# Altium project PCB_Project.PrjPcb
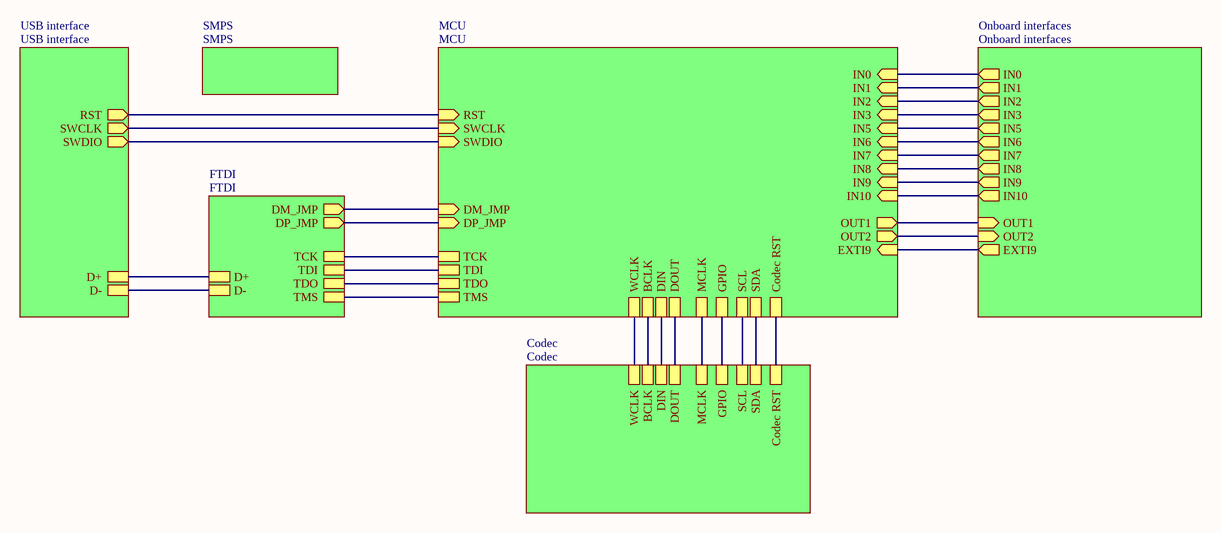
[diagram p0: Main.SchDoc]
7 sheets, 119 parts. Net scope: hierarchical (ports join the sheet entries above them; power ports are global).
Board file: MK1.PcbDoc
Sheets:
  Main.SchDoc
    MCU = MCU.SchDoc
    SMPS = SMPS.SchDoc
    USB interface = USB interface.SchDoc
    FTDI = FTDI.SchDoc
    Codec = Codec.SchDoc
    Onboard interfaces = Onboard interfaces.SchDoc

## Sheet Main.SchDoc
size A4; SheetNumber: 1; SheetTotal: 7

### Sub-sheets
Codec = Codec: WCLK, BCLK, DIN, DOUT, MCLK, GPIO, SCL, SDA, Codec RST
FTDI = FTDI: D+, D-, TCK, TDI, TDO, TMS, DM_JMP (out), DP_JMP (out)
MCU = MCU: TCK, TDI, TDO, TMS, WCLK, BCLK, DIN, DOUT, MCLK, GPIO, SCL, SDA, Codec RST, DM_JMP (in), DP_JMP (in), RST (in), SWCLK (in), SWDIO (in), IN0 (in), IN1 (in), IN2 (in), IN3 (in), IN5 (in), IN6 (in), IN7 (in), IN8 (in), IN9 (in), IN10 (in), OUT1 (out), OUT2 (out), EXTI9 (in)
Onboard interfaces = Onboard interfaces: IN0 (out), IN1 (out), IN2 (out), IN3 (out), IN5 (out), IN6 (out), IN7 (out), IN8 (out), IN9 (out), IN10 (out), OUT1 (in), OUT2 (in), EXTI9 (out)
SMPS = SMPS: no entries
USB interface = USB interface: D+, D-, RST (out), SWCLK (out), SWDIO (out)

### Nets
ADC1_IN0: sheet MCU/IN0, sheet Onboard interfaces/IN0
ADC1_IN1: sheet MCU/IN1, sheet Onboard interfaces/IN1
ADC1_IN2: sheet MCU/IN2, sheet Onboard interfaces/IN2
ADC1_IN3: sheet MCU/IN3, sheet Onboard interfaces/IN3
ADC1_IN5: sheet MCU/IN5, sheet Onboard interfaces/IN5
ADC1_IN6: sheet MCU/IN6, sheet Onboard interfaces/IN6
ADC1_IN7: sheet MCU/IN7, sheet Onboard interfaces/IN7
ADC1_IN8: sheet MCU/IN8, sheet Onboard interfaces/IN8
ADC1_IN9: sheet MCU/IN9, sheet Onboard interfaces/IN9
ADC1_IN10: sheet MCU/IN10, sheet Onboard interfaces/IN10
BCLK: sheet MCU/BCLK, sheet Codec/BCLK
Codec RST: sheet MCU/Codec RST, sheet Codec/Codec RST
D+: sheet USB interface/D+, sheet FTDI/D+
D-: sheet USB interface/D-, sheet FTDI/D-
DAC1_OUT1: sheet MCU/OUT1, sheet Onboard interfaces/OUT1
DAC1_OUT2: sheet MCU/OUT2, sheet Onboard interfaces/OUT2
DIN: sheet MCU/DIN, sheet Codec/DIN
DOUT: sheet MCU/DOUT, sheet Codec/DOUT
GPIO: sheet MCU/GPIO, sheet Codec/GPIO
I2C1_SCL: sheet MCU/SCL, sheet Codec/SCL
I2C1_SDA: sheet MCU/SDA, sheet Codec/SDA
I2S1_MCK: sheet MCU/MCLK, sheet Codec/MCLK
I2S1_WS: sheet MCU/WCLK, sheet Codec/WCLK
JTCK/SWCLK: sheet MCU/TCK, sheet MCU/SWCLK, sheet USB interface/SWCLK, sheet FTDI/TCK
JTDI: sheet MCU/TDI, sheet FTDI/TDI
JTDO: sheet MCU/TDO, sheet FTDI/TDO
JTMS/SWDIO: sheet MCU/TMS, sheet MCU/SWDIO, sheet USB interface/SWDIO, sheet FTDI/TMS
RST: sheet MCU/RST, sheet USB interface/RST
NetJ1_2: sheet MCU/DM_JMP, sheet FTDI/DM_JMP
NetJ6_2: sheet MCU/DP_JMP, sheet FTDI/DP_JMP
NetR17_2: sheet MCU/EXTI9, sheet Onboard interfaces/EXTI9

## Sheet MCU.SchDoc: MK1 MCU
size A3; Author: Mikkel Nielsen; DrawnBy: Mikkel Nielsen; Engineer: Mikkel Nielsen; SheetNumber: 2; SheetTotal: 7
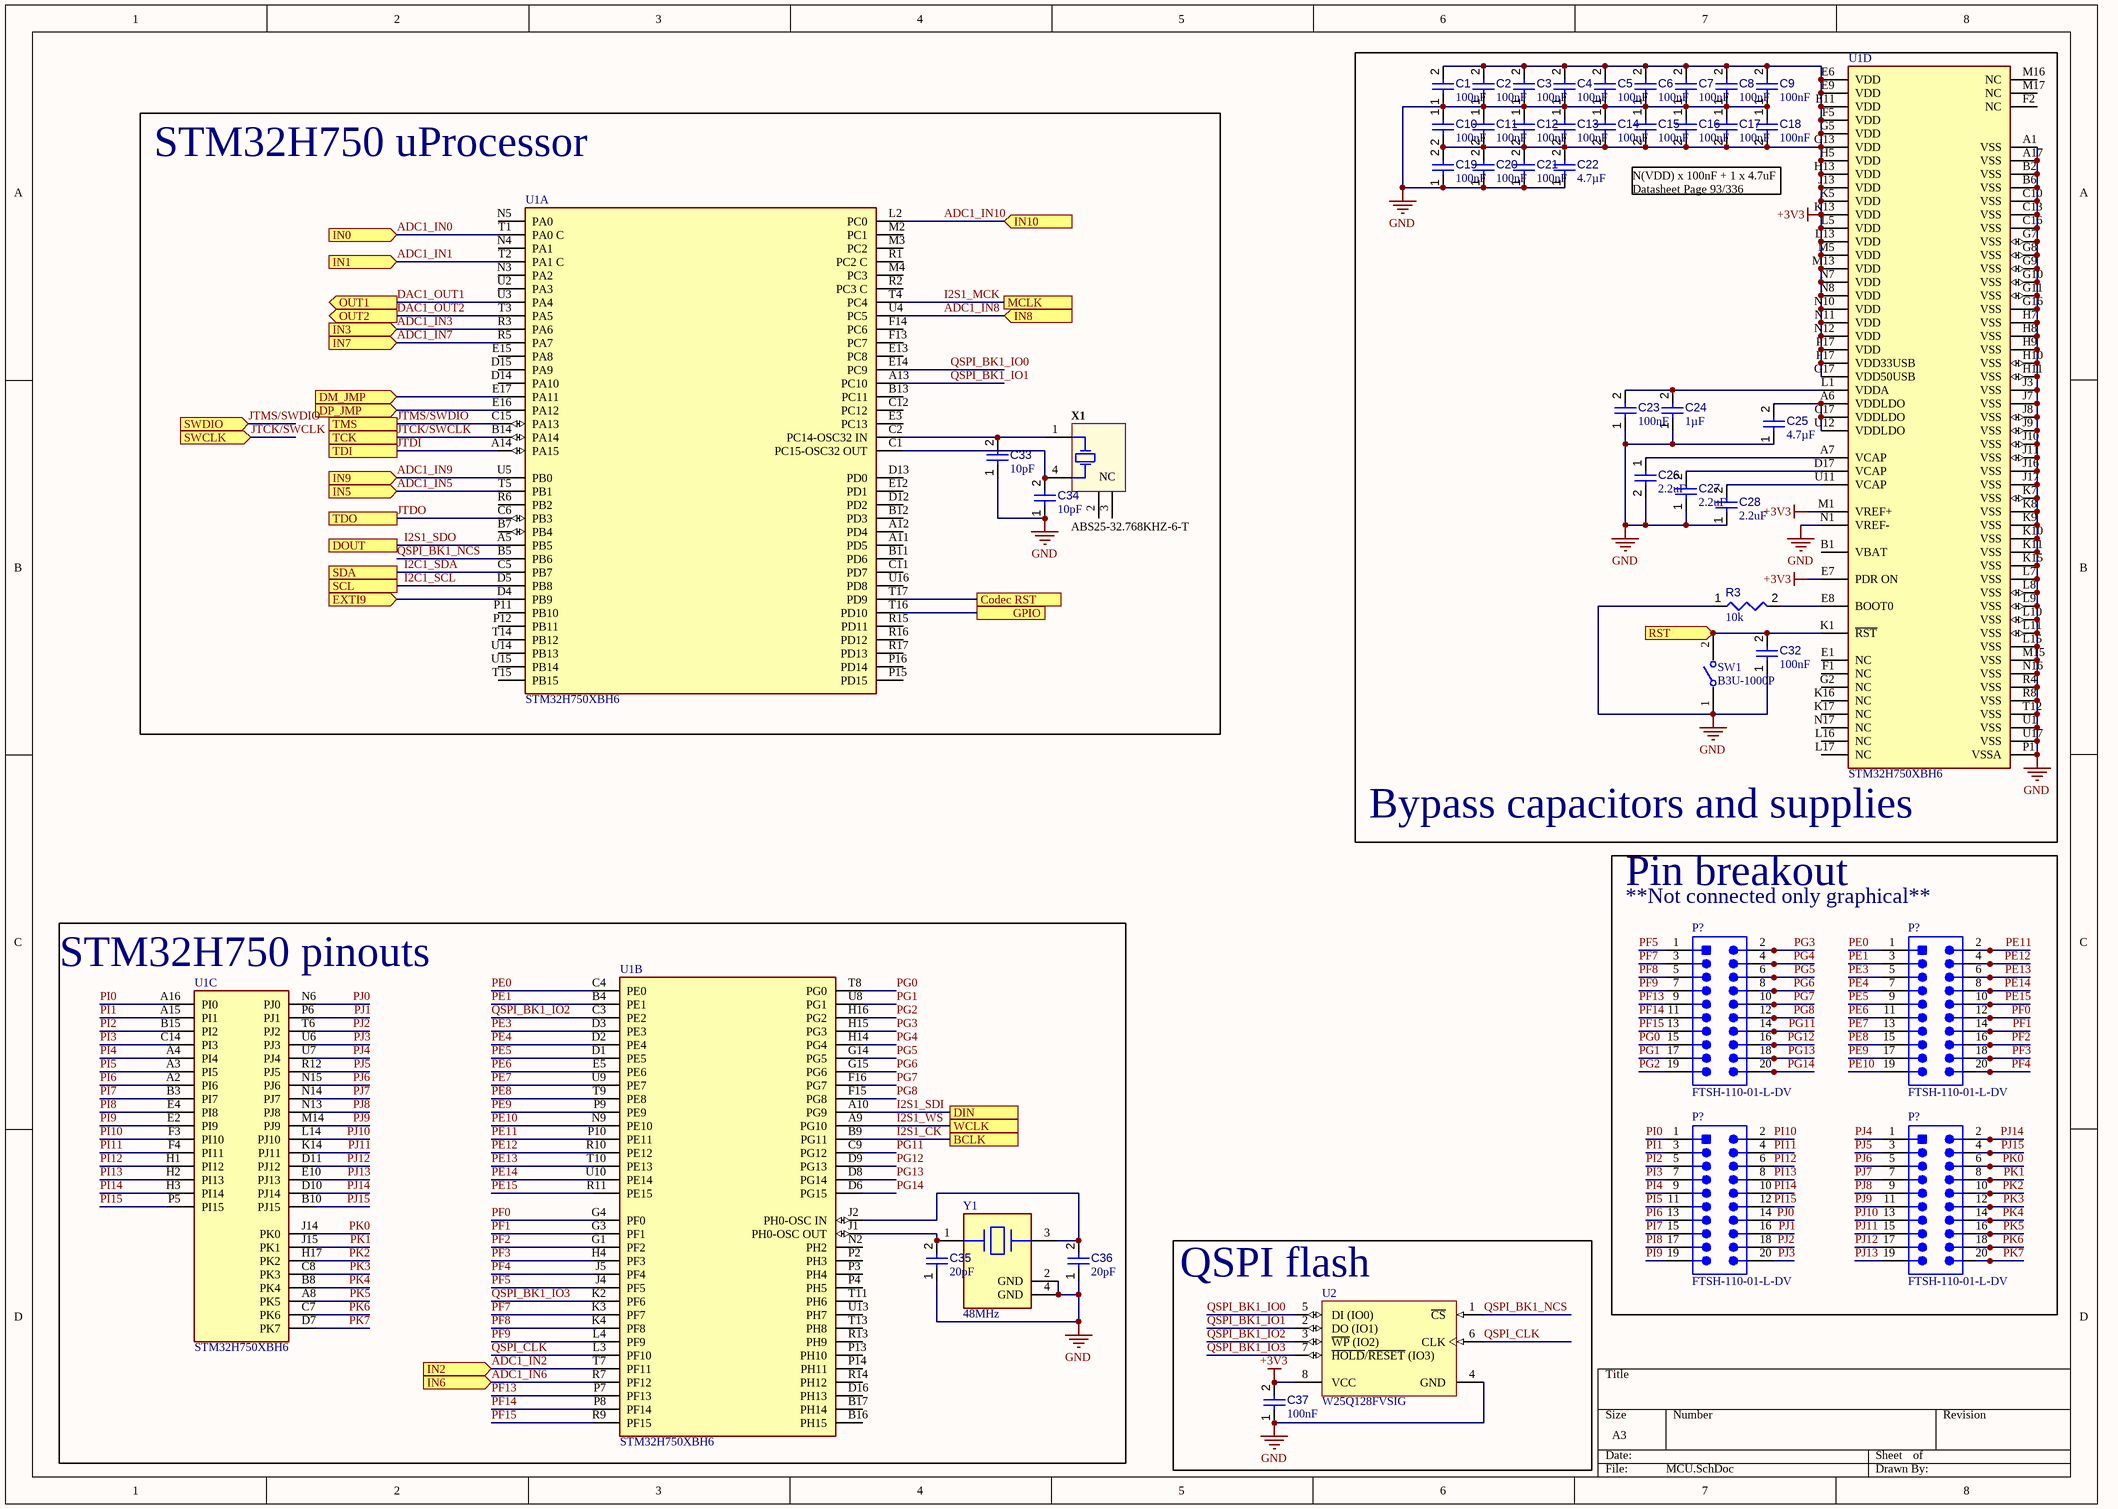
[diagram p1: MCU.SchDoc]

### Parts
(Parts that share a designator on the sheet are numbered #1, #2 ... from top to bottom, then left to right.)
C1  value 100nF  [CAPC0603(1608)100_L]  (hidden comment: Capacitor 470nF +/-20% 25V 0603)
C2  value 100nF  [CAPC0603(1608)100_L]  (hidden comment: Capacitor 470nF +/-20% 25V 0603)
C3  value 100nF  [CAPC0603(1608)100_L]  (hidden comment: Capacitor 470nF +/-20% 25V 0603)
C4  value 100nF  [CAPC0603(1608)100_L]  (hidden comment: Capacitor 470nF +/-20% 25V 0603)
C5  value 100nF  [CAPC0603(1608)100_L]  (hidden comment: Capacitor 470nF +/-20% 25V 0603)
C6  value 100nF  [CAPC0603(1608)100_L]  (hidden comment: Capacitor 470nF +/-20% 25V 0603)
C7  value 100nF  [CAPC0603(1608)100_L]  (hidden comment: Capacitor 470nF +/-20% 25V 0603)
C8  value 100nF  [CAPC0603(1608)100_L]  (hidden comment: Capacitor 470nF +/-20% 25V 0603)
C9  value 100nF  [CAPC0603(1608)100_L]  (hidden comment: Capacitor 470nF +/-20% 25V 0603)
C10  value 100nF  [CAPC0603(1608)100_L]  (hidden comment: Capacitor 470nF +/-20% 25V 0603)
C11  value 100nF  [CAPC0603(1608)100_L]  (hidden comment: Capacitor 470nF +/-20% 25V 0603)
C12  value 100nF  [CAPC0603(1608)100_L]  (hidden comment: Capacitor 470nF +/-20% 25V 0603)
C13  value 100nF  [CAPC0603(1608)100_L]  (hidden comment: Capacitor 470nF +/-20% 25V 0603)
C14  value 100nF  [CAPC0603(1608)100_L]  (hidden comment: Capacitor 470nF +/-20% 25V 0603)
C15  value 100nF  [CAPC0603(1608)100_L]  (hidden comment: Capacitor 470nF +/-20% 25V 0603)
C16  value 100nF  [CAPC0603(1608)100_L]  (hidden comment: Capacitor 470nF +/-20% 25V 0603)
C17  value 100nF  [CAPC0603(1608)100_L]  (hidden comment: Capacitor 470nF +/-20% 25V 0603)
C18  value 100nF  [CAPC0603(1608)100_L]  (hidden comment: Capacitor 470nF +/-20% 25V 0603)
C19  value 100nF  [CAPC0603(1608)100_L]  (hidden comment: Capacitor 470nF +/-20% 25V 0603)
C20  value 100nF  [CAPC0603(1608)100_L]  (hidden comment: Capacitor 470nF +/-20% 25V 0603)
C21  value 100nF  [CAPC0603(1608)100_L]  (hidden comment: Capacitor 470nF +/-20% 25V 0603)
C22  value 4.7µF  [CAPC0603(1608)100_L]  (hidden comment: Capacitor 4.7µF +/-20% 10V 0603)
C23  value 100nF  [CAPC0603(1608)100_L]  (hidden comment: Capacitor 470nF +/-20% 25V 0603)
C24  value 1µF  [CAPC0603(1608)100_L]  (hidden comment: Capacitor 1µF +/-40% 50V 0603)
C25  value 4.7µF  [CAPC0603(1608)100_L]  (hidden comment: Capacitor 4.7µF +/-20% 10V 0603)
C26  value 2.2uF  [CAPC0603(1608)100_L]  (hidden comment: Capacitor 470nF +/-20% 25V 0603)
C27  value 2.2uF  [CAPC0603(1608)100_L]  (hidden comment: Capacitor 470nF +/-20% 25V 0603)
C28  value 2.2uF  [CAPC0603(1608)100_L]  (hidden comment: Capacitor 470nF +/-20% 25V 0603)
C32  value 100nF  [CAPC0603(1608)100_L]  (hidden comment: Capacitor 470nF +/-20% 25V 0603)
C33  value 10pF  [CAPC0603(1608)100_L]  (hidden comment: Capacitor 470nF +/-20% 25V 0603)
C34  value 10pF  [CAPC0603(1608)100_L]  (hidden comment: Capacitor 470nF +/-20% 25V 0603)
C35  value 20pF  [CAPC0603(1608)100_L]  (hidden comment: Capacitor 470nF +/-20% 25V 0603)
C36  value 20pF  [CAPC0603(1608)100_L]  (hidden comment: Capacitor 470nF +/-20% 25V 0603)
C37  value 100nF  [CAPC0603(1608)100_L]  (hidden comment: Capacitor 470nF +/-20% 25V 0603)
P?#1  FTSH-110-01-L-DV  [SMTC-FTSH-110-01-L-DV_V]  (graphical)
P?#2  FTSH-110-01-L-DV  [SMTC-FTSH-110-01-L-DV_V]  (graphical)
P?#3  FTSH-110-01-L-DV  [SMTC-FTSH-110-01-L-DV_V]  (graphical)
P?#4  FTSH-110-01-L-DV  [SMTC-FTSH-110-01-L-DV_V]  (graphical)
R3  value 10k  [RESC0603(1608)_L]  (hidden comment: 120R3J)
SW1  B3U-1000P  [FP-B3U-1000P-MFG]
U1  STM32H750XBH6  [FP-TFBGA2650-A07U-MFG]  (parts A,B,C,D of 4)
U2  W25Q128FVSIG  [WINB-SOIC-8_M]
X1  ABS25-32.768KHZ-6-T  [ABRA-ABS25-4_V]
Y1  48MHz  [FP-ABM3B-MFG]

### Blocks framed on the sheet
Bypass capacitors and supplies: C1-C28 C32 R3 SW1 U1
STM32H750 uProcessor: C33 C34 U1 X1
Pin breakout: P?#1-P?#4
STM32H750 pinouts: C35 C36 U1 Y1
QSPI flash: C37 U2

### Ports
BCLK, Codec RST, DIN, DM_JMP (in), DOUT, DP_JMP (in), EXTI9 (in), GPIO, IN0 (in), IN1 (in), IN2 (in), IN3 (in), IN5 (in), IN6 (in), IN7 (in), IN8 (in), IN9 (in), IN10 (in), MCLK, OUT1 (out), OUT2 (out), RST (in), SCL, SDA, SWCLK (in), SWDIO (in), TCK, TDI, TDO, TMS, WCLK

### Nets
+3V3: C1.2 C2.2 C3.2 C4.2 C5.2 C6.2 C7.2 C8.2 C9.2 C10.2 C11.2 C12.2 C13.2 C14.2 C15.2 C16.2 C17.2 C18.2 C19.2 C20.2 C21.2 C22.2 C37.2 U1.E6(VDD) U1.E7(PDR_ON) U1.E9(VDD) U1.E11(VDD) U1.F5(VDD) U1.F17(VDD33USB) U1.G5(VDD) U1.G13(VDD) U1.G17(VDD50USB) U1.H5(VDD) U1.H13(VDD) U1.J13(VDD) U1.K5(VDD) U1.K13(VDD) U1.L5(VDD) U1.L13(VDD) U1.M1(VREF+) U1.M5(VDD) U1.M13(VDD) U1.N7(VDD) U1.N8(VDD) U1.N10(VDD) U1.N11(VDD) U1.N12(VDD) U1.P17(VDD) U2.8(VCC)
GND: C1.1 C2.1 C3.1 C4.1 C5.1 C6.1 C7.1 C8.1 C9.1 C10.1 C11.1 C12.1 C13.1 C14.1 C15.1 C16.1 C17.1 C18.1 C19.1 C20.1 C21.1 C22.1 C23.1 C24.1 C25.1 C26.2 C27.1 C28.1 C32.1 C33.1 C34.1 C35.1 C36.1 C37.1 R3.1 SW1.1 U1.A1(VSS) U1.A17(VSS) U1.B2(VSS) U1.B6(VSS) U1.C10(VSS) U1.C13(VSS) U1.C16(VSS) U1.G7(VSS) U1.G8(VSS) U1.G9(VSS) U1.G10(VSS) U1.G11(VSS) U1.G16(VSS) U1.H7(VSS) U1.H8(VSS) U1.H9(VSS) U1.H10(VSS) U1.H11(VSS) U1.J3(VSS) U1.J7(VSS) U1.J8(VSS) U1.J9(VSS) U1.J10(VSS) U1.J11(VSS) U1.J16(VSS) U1.J17(VSS) U1.K7(VSS) U1.K8(VSS) U1.K9(VSS) U1.K10(VSS) U1.K11(VSS) U1.K15(VSS) U1.L7(VSS) U1.L8(VSS) U1.L9(VSS) U1.L10(VSS) U1.L11(VSS) U1.L15(VSS) U1.M15(VSS) U1.N1(VREF-) U1.N16(VSS) U1.P1(VSSA) U1.R4(VSS) U1.R8(VSS) U1.T12(VSS) U1.U1(VSS) U1.U17(VSS) U2.4(GND) Y1.2(GND) Y1.4(GND)
ADC1_IN0: U1.T1(PA0_C) ; port IN0
ADC1_IN1: U1.T2(PA1_C) ; port IN1
ADC1_IN2: U1.T7(PF11) ; port IN2
ADC1_IN3: U1.R3(PA6) ; port IN3
ADC1_IN5: U1.T5(PB1) ; port IN5
ADC1_IN6: U1.R7(PF12) ; port IN6
ADC1_IN7: U1.R5(PA7) ; port IN7
ADC1_IN8: U1.U4(PC5) ; port IN8
ADC1_IN9: U1.U5(PB0) ; port IN9
ADC1_IN10: U1.L2(PC0) ; port IN10
Codec RST: U1.T17(PD9) ; port Codec RST
DAC1_OUT1: U1.U3(PA4) ; port OUT1
DAC1_OUT2: U1.T3(PA5) ; port OUT2
GPIO: U1.T16(PD10) ; port GPIO
I2C1_SCL: U1.D5(PB8) ; port SCL
I2C1_SDA: U1.C5(PB7) ; port SDA
I2S1_CK: U1.B9(PG11) ; port BCLK  [project net BCLK]
I2S1_MCK: U1.T4(PC4) ; port MCLK
I2S1_SDI: U1.A10(PG9) ; port DIN  [project net DIN]
I2S1_SDO: U1.A5(PB5) ; port DOUT  [project net DOUT]
I2S1_WS: U1.A9(PG10) ; port WCLK
JTCK/SWCLK: U1.B14(PA14) ; port TCK, port SWCLK
JTDI: U1.A14(PA15) ; port TDI
JTDO: U1.C6(PB3) ; port TDO
JTMS/SWDIO: U1.C15(PA13) ; port TMS, port SWDIO
PE0: P?#2.1 U1.C4(PE0)
PE1: P?#2.3 U1.B4(PE1)
PE3: P?#2.5 U1.D3(PE3)
PE4: P?#2.7 U1.D2(PE4)
PE5: P?#2.9 U1.D1(PE5)
PE6: P?#2.11 U1.E5(PE6)
PE7: P?#2.13 U1.U9(PE7)
PE8: P?#2.15 U1.T9(PE8)
PE9: P?#2.17 U1.P9(PE9)
PE10: P?#2.19 U1.N9(PE10)
PE11: P?#2.2 U1.P10(PE11)
PE12: P?#2.4 U1.R10(PE12)
PE13: P?#2.6 U1.T10(PE13)
PE14: P?#2.8 U1.U10(PE14)
PE15: P?#2.10 U1.R11(PE15)
PF0: P?#2.12 U1.G4(PF0)
PF1: P?#2.14 U1.G3(PF1)
PF2: P?#2.16 U1.G1(PF2)
PF3: P?#2.18 U1.H4(PF3)
PF4: P?#2.20 U1.J5(PF4)
PF5: P?#1.1 U1.J4(PF5)
PF7: P?#1.3 U1.K3(PF7)
PF8: P?#1.5 U1.K4(PF8)
PF9: P?#1.7 U1.L4(PF9)
PF13: P?#1.9 U1.P7(PF13)
PF14: P?#1.11 U1.P8(PF14)
PF15: P?#1.13 U1.R9(PF15)
PG0: P?#1.15 U1.T8(PG0)
PG1: P?#1.17 U1.U8(PG1)
PG2: P?#1.19 U1.H16(PG2)
PG3: P?#1.2 U1.H15(PG3)
PG4: P?#1.4 U1.H14(PG4)
PG5: P?#1.6 U1.G14(PG5)
PG6: P?#1.8 U1.G15(PG6)
PG7: P?#1.10 U1.F16(PG7)
PG8: P?#1.12 U1.F15(PG8)
PG11: P?#1.14 U1.C9(PG12)
PG12: P?#1.16 U1.D9(PG13)
PG13: P?#1.18 U1.D8(PG14)
PG14: P?#1.20 U1.D6(PG15)
PI0: P?#3.1 U1.A16(PI0)
PI1: P?#3.3 U1.A15(PI1)
PI2: P?#3.5 U1.B15(PI2)
PI3: P?#3.7 U1.C14(PI3)
PI4: P?#3.9 U1.A4(PI4)
PI5: P?#3.11 U1.A3(PI5)
PI6: P?#3.13 U1.A2(PI6)
PI7: P?#3.15 U1.B3(PI7)
PI8: P?#3.17 U1.E4(PI8)
PI9: P?#3.19 U1.E2(PI9)
PI10: P?#3.2 U1.F3(PI10)
PI11: P?#3.4 U1.F4(PI11)
PI12: P?#3.6 U1.H1(PI12)
PI13: P?#3.8 U1.H2(PI13)
PI14: P?#3.10 U1.H3(PI14)
PI15: P?#3.12 U1.P5(PI15)
PJ0: P?#3.14 U1.N6(PJ0)
PJ1: P?#3.16 U1.P6(PJ1)
PJ2: P?#3.18 U1.T6(PJ2)
PJ3: P?#3.20 U1.U6(PJ3)
PJ4: P?#4.1 U1.U7(PJ4)
PJ5: P?#4.3 U1.R12(PJ5)
PJ6: P?#4.5 U1.N15(PJ6)
PJ7: P?#4.7 U1.N14(PJ7)
PJ8: P?#4.9 U1.N13(PJ8)
PJ9: P?#4.11 U1.M14(PJ9)
PJ10: P?#4.13 U1.L14(PJ10)
PJ11: P?#4.15 U1.K14(PJ11)
PJ12: P?#4.17 U1.D11(PJ12)
PJ13: P?#4.19 U1.E10(PJ13)
PJ14: P?#4.2 U1.D10(PJ14)
PJ15: P?#4.4 U1.B10(PJ15)
PK0: P?#4.6 U1.J14(PK0)
PK1: P?#4.8 U1.J15(PK1)
PK2: P?#4.10 U1.H17(PK2)
PK3: P?#4.12 U1.C8(PK3)
PK4: P?#4.14 U1.B8(PK4)
PK5: P?#4.16 U1.A8(PK5)
PK6: P?#4.18 U1.C7(PK6)
PK7: P?#4.20 U1.D7(PK7)
QSPI_BK1_IO0: U1.E14(PC9) U2.5(DI_(IO0))
QSPI_BK1_IO1: U1.A13(PC10) U2.2(DO_(IO1))
QSPI_BK1_IO2: U1.C3(PE2) U2.3(~{WP}_(IO2))
QSPI_BK1_IO3: U1.K2(PF6) U2.7(~{HOLD}/~{RESET}_(IO3))
QSPI_BK1_NCS: U1.B5(PB6) U2.1(~{CS})
QSPI_CLK: U1.L3(PF10) U2.6(CLK)
RST: C32.2 SW1.2 U1.K1(~{RST}) ; port RST
NetC23_2: C23.2 C24.2 U1.L1(VDDA)
NetC25_2: C25.2 U1.A6(VDDLDO) U1.C17(VDDLDO) U1.U12(VDDLDO)
NetC26_1: C26.1 U1.A7(VCAP)
NetC27_2: C27.2 U1.D17(VCAP)
NetC28_2: C28.2 U1.U11(VCAP)
NetC33_2: C33.2 U1.C2(PC14-OSC32_IN) X1.1(X1)
NetC34_2: C34.2 U1.C1(PC15-OSC32_OUT) X1.4(X2)
NetC35_2: C35.2 U1.J1(PH0-OSC_OUT) Y1.1
NetC36_2: C36.2 U1.J2(PH0-OSC_IN) Y1.3
NetJ1_2: U1.E17(PA11) ; port DM_JMP
NetJ6_2: U1.E16(PA12) ; port DP_JMP
NetR3_2: R3.2 U1.E8(BOOT0)
NetR17_2: U1.D4(PB9) ; port EXTI9

Not connected (* = marked no-connect by the designer): U1 A11(PD5) A12(PD4) B1(VBAT) B7(PB4) B11(PD6) B12(PD3) B13(PC11) B16(PH15) B17(PH14) C11(PD7) C12(PC12) D12(PD2) D13(PD0) D14(PA10) D15(PA9) D16(PH13) E1(NC) E3(PC13) E12(PD1) E13(PC8) E15(PA8) F1(NC) F2(NC) F13(PC7) F14(PC6) G2(NC) K16(NC) K17(NC) L16(NC) L17(NC) M2(PC1) M3(PC2) M4(PC3) M16(NC) M17(NC) N2(PH2) N3(PA2) N4(PA1) N5(PA0) N17(NC) P2(PH3) P3(PH4) P4(PH5) P11(PB10) P12(PB11) P13(PH10) P14(PH11) P15(PD15) P16(PD14) R1(PC2_C) R2(PC3_C) R6(PB2) R13(PH9) R14(PH12) R15(PD11) R16(PD12) R17(PD13) T11(PH6) T13(PH8) T14(PB12) T15(PB15) U2(PA3) U13(PH7) U14(PB13) U15(PB14) U16(PD8); X1 2(NC) 3(NC)

### Notes on the sheet
- N(VDD) x 100nF + 1 x 4.7uF
  Datasheet Page 93/336
- (near P?#2) **Not connected only graphical**

### Library data of the parts
C1-C21 C23 C26-C28 C32-C37 = CMP-001-00077-3: Chip Capacitor, 470nF +/-20%, 25V, 0603, Thickness 1 mm; Tolerance: 10%; Max Operating Temperature: 85°C; Voltage Rating: 25V; Pins: 2; Case/Package: 0603; Mounting Technology: SMT; Min Operating Temperature: -55°C
C22 C25 = CMP-001-00076-4: Chip Capacitor, 4.7µF +/-20%, 10V, 0603, Thickness 1 mm; Tolerance: 10%; Mounting Technology: SMT; Case/Package: 0603; Pins: 2; Min Operating Temperature: -55°C; Max Operating Temperature: 85°C; Voltage Rating: 10V
C24 = CMP-001-00078-4: Chip Capacitor, 1µF +/-40%, 50V, 0603, Thickness 1 mm; Tolerance: 10%; Case/Package: 0603; Pins: 2; Max Operating Temperature: 85°C; Voltage Rating: 50V; Mounting Technology: SMT; Min Operating Temperature: -55°C
P?#1-P?#4 = CMP-2000-06294-2: Male Header, Pitch 1.27 mm, 2 x 10 Position, Height 6.1 mm, -55 to 125 degC, RoHS, Tube; Manufacturer: Samtec; Online Catalog: FTSHSeries; Row Spacing: 0.050"(1.27mm); Number of Positions Loaded: All; Connector Type: Header,Unshrouded; Product Training Modules: Board-to-BoardConnectors; Featured Product: Board-To-BoardInterconnectSystems; Other Names: SAM1161-10; Mating Products: SAM9021-ND-CONNRECEPT20POS.50"SMTFLE-110-01-G-DV-TR-ND-CONNSKT1.27MM20POSDUALSMDFLE-110-01-G-DV-K-TR-ND-CONNSKT1.27MM20POSDUALSMDFLE-110-01-G-DV-A-K-TR-ND-CONNSKT1.27MM20POSDUALSMDSFMC-110-L2-S-D-P-TR-ND-CONN.05"SURFACE20POSSMTSAM1153-10-ND-CONNRCPT20POSDUAL.05"SMDSAM1155-10-ND-CONNRCPT20POSDUAL.05"SMDSAM1154-10-ND-CONNRCPT20POSDUAL.05"SMDSFMC-110-L3-S-D-ND-CONN.05"SURFACE20POSSTRAIGHTSFMC-110-02-S-D-ND-CONN.05"SURFACE20POSSMTSAM1226-10-ND-CONNRCPT.05"20POSDUALSMD; EDA / CAD Models: DownloadfromAcceleratedDesigns; Number of Positions: 20; Catalog Drawings: FTSHSeriesFTSHSeriesSMTSide; Package Reference: FTSH-110-01-L-DV; Family: RectangularConnectors-Headers,MalePins; Mounting Technology: SurfaceMount; Contact Type: MalePin; Manufacturer URL: http://www.samtec.com/; Package URL: http://suddendocs.samtec.com/prints/ftsh-1xx-xx-xxx-dv-xxx-xxx-mkt.pdf; Package Description: Male Header, Pitch 1.27 mm, 2 x 10 Position, Height 6.1 mm; Packaging: Bulk; Termination: Solder; Category: Connectors,Interconnects; Fastening Type: -; Datasheet Version: F-215 , 02/2016; Contact Finish Thickness: 10µin(0.25µm); Number of Rows: 2; Datasheet URL: http://suddendocs.samtec.com/catalog_english/ftsh_smt.pdf; Mounting Type: SurfaceMount; Series: FTSH; Features: -; Contact Finish: Gold; Standard Package: 1; Color: Black; Pitch: 0.050"(1.27mm); Contact Mating Length: 0.120"(3.05mm)
R3 = CMP-009-00069-2: 120R 0.1W 5% 0603 (1608 Metric)  SMD; Power: 100mW; Mounting Technology: SMT; Tolerance: 5%; Case/Package: 0603; Pins: 2
SW1 = CMP-2100-03586-2: SWITCH TACTILE SPST-NO 0.05A 12V; Contact Resistance: 100mR; Operating Force: 1.5N; Max Current Rating: 50mA; Switch Travel: 0.15mm; Actuator Type: Standard; Mechanical Life: 200000Cycles; Ratings: Dust Proof; Illumination Type: Non-Illuminated; Throw Configuration: SPST; Actuator Length: 0.4mm; Switch Function: Off-Mom; Height: 1.2mm; Width: 3mm; Weight: 0.000776oz; Contact Material: Silver; Max Voltage Rating (DC): 12V; Insulation Resistance: 100MR; Lead Free: Lead Free; Current Rating: 50mA; Termination: SMD/SMT; Length: 4mm; Voltage Rating (DC): 12V; Contact Current Rating: 50mA; Orientation: Straight; Depth: 2.5mm; Max Operating Temperature: 70°C; Packaging: Tape and Reel; Min Operating Temperature: -25°C; Package Quantity: 1; Mount: Surface Mount; Electrical Life: 200000Cycles
U1 = CMP-12105-000062-1: IC MCU 32BIT 128KB FLASH TFBGA; Manufacturer: STMicroelectronics; Number Of Cores: 1; Ram Size: 1MBytes; Interface: I2C,SPI,UART,USART,CAN,USB,LIN,IrDA,Ethernet,I2S; Number Of Timers/Counters: 10; Number Of Pwm Channels: 2; Core Architecture: ARM Cortex-M7; Frequency: 400MHz; Number Of Spi Channels: 6; Number Of Uart Channels: 9; Min Supply Voltage: 1.62V; Max Junction Temp: +125°C; Standoff Height: 0.15mm; Memory Size: 128KBytes; Nominal Supply Current: 24-348mA; Max Supply Voltage: 3.6V; Data Bus Width: 32bits; Number Of I2C Channels: 4; Number Of Adc Channels: 36; Number Of I/Os: 168; Number Of A/D Converters: 3; RoHS: TRUE; Package: TFBGA2650-A07U; Ambient Temperature Range Low: -40°C; Temperature Range High: +125°C; ComponentLink2Description: Datasheet; Number Of Usb Channels: 1; Device Class L2: Embedded Processors and Controllers; Automotive: No; Ambient Temperature Range High: +85°C; Octopart: https://octopart.com/stm32h750xbh6-stmicroelectronics-93259822; Lead Free: Yes; Ipc Land Pattern Name: BGA289N80P17X17_1400X1400X110; Manufacturer Part Number: STM32H750XBH6; Device Class L1: Integrated Circuits (ICs); Temperature: -40°C to +125°C; Device Class L3: Microcontrollers; ComponentLink2URL: https://www.st.com/resource/en/datasheet/stm32h750xb.pdf; Temperature Range Low: -40°C; Digikey Description: IC MCU 32BIT 128KB FLASH TFBGA; Number Of Ethernet Channels: 1; Height: 1.1mm; Category: IC; Memory Type: FLASH
U2 = CMP-2000-05005-1: 3V 128M-Bit Serial Flash Memory with Dual/Quad SPI & QPI, 2.7 to 3.6 V, -40 to 85 degC, 8-Pin SOIC, RoHS, Tape and Reel; Manufacturer: Winbond; Number of Words: 16777216; Address Bus: 24b; Word Size: 8b; Boot Type: NotRequired; Supply Current: 20mA; Operating Supply Voltage (Max): 3.6V; Sync/Async: Synchronous; Rad Hardened: No; Interface Type: Serial(SPI); Access Time (Max): 7ns; Operating Supply Voltage (Min): 2.7V; Operating Supply Voltage (Typ): 3/3.3V; Programmable: Yes; Density: 134217728Bit; Cell Type: NOR; Package Description: 8-Pin Small Outline Integrated Circuit, Body 5.28 x 5.28 mm, Pitch 1.27 mm; Datasheet URL: http://download.siliconexpert.com/pdfs/2015/11/30/6/42/17/890/win_/manual/3w25q128fv20rev.l2008242015.pdf; Package Reference: SS-8; Package Type: SOICW; Datasheet Version: Rev. L, 08/2015; Manufacturer URL: http://www.winbond.com/hq/index.html?__locale=en; Pin Count: 8; Operating Temperature Classification: Industrial; Operating Temperature (Min): -40C; Program/Erase Volt (Typ): 2.7to3.6V; Operating Temperature (Max): 85C; Mounting: SurfaceMount; Operating Temp Range: -40Cto85C
X1 = CMP-2000-05036-1: Low Frequency Crystal, 32.768 KHz, 6 pF, +/- 20 ppm, -40 to 85 degC, 4-Pin SMD, RoHS, Tape and Reel; Manufacturer: Abracon; Tolerance: 20PPM; ESR: 50kOhms; Case Width: 3.8mm; Case Height: 2.5mm; Case Length: 8mm; Load Capacitance: 6pF; Operating Temperature Range: -40Cto+85C; Package Reference: ABS25; Factory Pack Quantity: 3000; Package Description: 4-Pin Surface Mount Device, Body 8 x 3.8 mm, Pitch 5.5 mm; Frequency: 32.768kHz; Termination Style: SMD/SMT; Manufacturer URL: http://www.abracon.com/; Type: LowFrequencyCrystal; Dimensions: 3.8mmWx8mmLx2.5mmH; Product Category: Crystals; Series: ABS25; RoHS: Details; Package / Case: 8mmx3.8mm; Datasheet Version: Jun-17; Brand: ABRACON; Datasheet URL: https://datasheet.ciiva.com/854/abs25-854528.pdf; Packaging: Reel; Mounting Style: SMD/SMT
Y1 = CMP-27762-010589-1: Crystal 48MHz ±20ppm 18pF SMD-4 5mm x 3.2mm; Frequency Stability: 50ppm; Series Resistance: 50R; Package Quantity: 1000; Packaging: Tape and Reel; Frequency Tolerance: 20ppm; Depth: 3.2mm; Max Operating Temperature: 70°C; Lead Free: Lead Free; ESR (Equivalent Series Resistance): 50R; Operating Frequency: 48 MHz; REACH SVHC: No SVHC; Frequency: 48MHz; Length: 5mm; Min Operating Temperature: -20°C; Tolerance: 20ppm; Load Capacitance: 18pF; Case/Package: SMD/SMT; Series: ABM3B; Number of Pins: 4; Termination: SMD/SMT; Height: 0.043inch; Resistor Type: Ceramic; Mount: Surface Mount; Width: 3.2mm

## Sheet SMPS.SchDoc
size A4; SheetNumber: 4; SheetTotal: 7
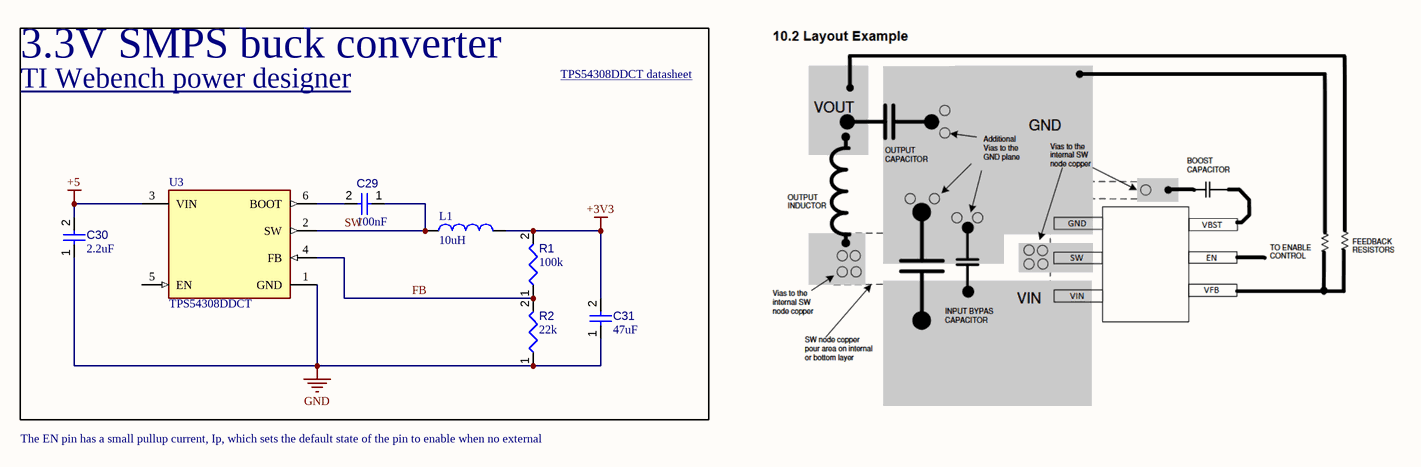
[diagram p2: SMPS.SchDoc]

### Parts
C29  value 100nF  [CAPC0805(2012)145_L]  (hidden comment: Capacitor 4.7µF +/-40% 25V 0805)
C30  value 2.2uF  [CAPC0603(1608)100_L]  (hidden comment: Capacitor 4.7µF +/-20% 10V 0603)
C31  value 47uF  [CAPC1608X90X35ML15T15]  (hidden comment: Capacitor 1uF +/- 10% 16V 0603)
L1  10uH  [WE-PD2A_7850]
R1  value 100k  [RESC0402(1005)_L]  (hidden comment: 121KR2F)
R2  value 22k  [RESC0603(1608)_L]  (hidden comment: 120R3J)
U3  TPS54308DDCT  [FP-DDC0006A-IPC_A]

### Nets
+3V3: C31.2 L1.2 R1.2
+5: C30.2 U3.3(VIN)
GND: C30.1 C31.1 R2.1 U3.1(GND)
FB: R1.1 R2.2 U3.4(FB)
SW: C29.1 L1.1 U3.2(SW)
NetC29_2: C29.2 U3.6(BOOT)

Not connected (* = marked no-connect by the designer): U3 5(EN)

### Notes on the sheet
- 3.3V SMPS buck converter
- TI Webench power designer <https://webench.ti.com/power-designer/switching-regulator>
- TPS54308DDCT datasheet <https://www.ti.com/lit/ds/symlink/tps54308.pdf>
- The EN pin has a small pullup current, Ip, which sets the default state of the pin to enable when no external

### Library data of the parts
C29 = CMP-001-00080-4: Chip Capacitor, 4.7µF +/-40%, 25V, 0805, Thickness 1.45 mm; Tolerance: 20%; Voltage Rating: 25V; Min Operating Temperature: -55°C; Max Operating Temperature: 85°C; Pins: 2; Mounting Technology: SMT; Case/Package: 0805
C30 = CMP-001-00076-4: as C22 on sheet MCU; Mounting Technology: SMT; Case/Package: 0603; Pins: 2; Min Operating Temperature: -55°C; Max Operating Temperature: 85°C; Voltage Rating: 10V
C31 = CMP-001-00004-6: Chip Capacitor, 1 uF, +/- 10%, 16 V, 0603 (1608 Metric); Capacitor Type: Ceramic; Mounting Technology: SM; RoHS Compliant: True; Min Operating Temperature: -55°C; Case/Package: 0603; Pins: 2; Voltage Rating: 16V; Max Operating Temperature: 125°C; Tolerance: 10%
L1 = CMP-03913-56466919-1: 78477510 Inductor, Aec-Q200, 10Uh, Unshld, 2.3A Rohs Compliant: Yes; Voltage Rating: 80V; Shielding: Unshielded; Tolerance: 20%; DC Resistance (DCR): 40mΩ; Saturation Current: 2.95A; Inductance: 10µH; Core Material: Ferrite; Self Resonant Frequency: 23MHz; Test Frequency: 10kHz; Composition: Wirewound; Width: 7.8mm; Ambient Temperature Range Low: -40°C; RoHS: Compliant; Ambient Temperature Range High: 85°C; Height: 5mm; Number of Pins: 2; Current Rating: 2.3A; Mount: Surface Mount; Min Operating Temperature: -40°C; NexarPartId: 56466919; Ratings: AEC-Q200; Height - Seated (Max): 5.5118mm; Case/Package: Nonstandard; Max Operating Temperature: 125°C; Length: 7mm
R1 = CMP-009-00070-2: 121K 0.063W 1% 0402 (1005 Metric)  SMD; Power: 63mW; Case/Package: 0402; Pins: 2; Tolerance: 1%; Mounting Technology: SMT
R2 = CMP-009-00069-2: as R3 on sheet MCU; Mounting Technology: SMT; Tolerance: 5%; Case/Package: 0603; Pins: 2
U3 = CMP-04918-000241-1: IC REG BUCK ADJ 3A TSOT23-6; Max Input Voltage: 28V; Synchronous Rectifier: Yes; Max Output Voltage: 26V; Switching Frequency: 350kHz; Number of Outputs: 1; Output Configuration: Positive; Output Type: Adjustable; Min Input Voltage: 4.5V; Min Output Voltage: 1V; Min Operating Temperature: -40°C; Case/Package: SOT-23-6; Mount: Surface Mount; RoHS Compliant: Yes; Max Operating Temperature: 125°C; Output Current: 3A; Packaging: Tape and Reel

## Sheet USB interface.SchDoc
size A4; SheetNumber: 3; SheetTotal: 7
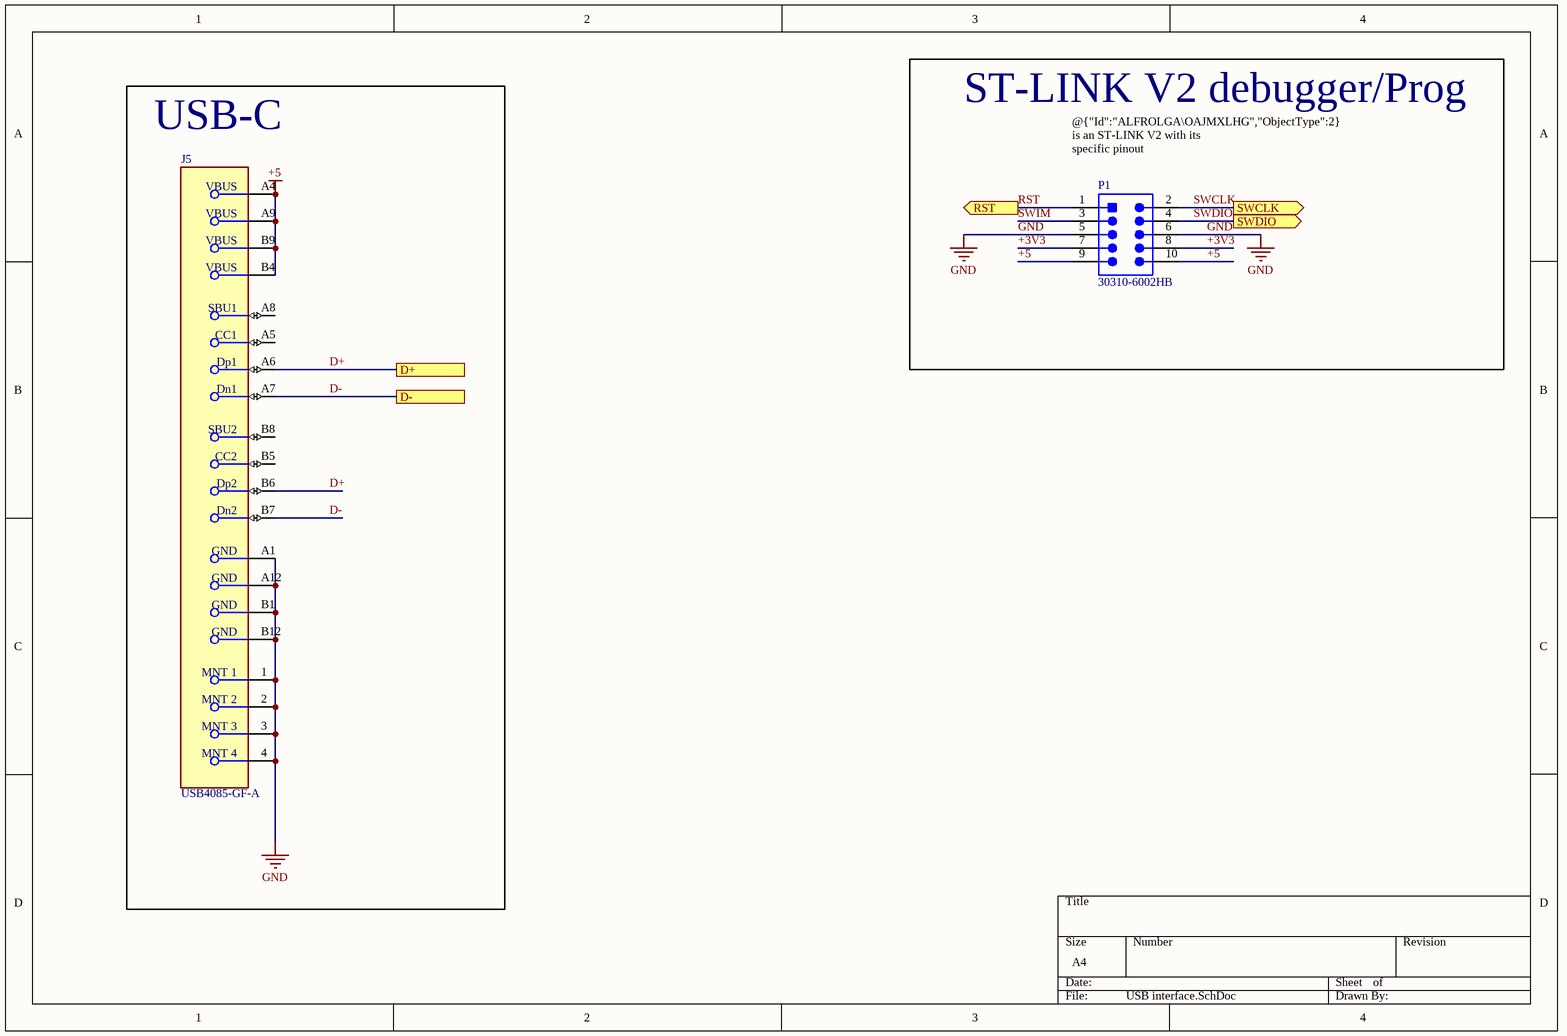
[diagram p3: USB interface.SchDoc]

### Parts
J5  USB4085-GF-A  [FP-USB4085-GF-A-MFG]
P1  30310-6002HB  [3M-30310-6002HB-10_V]

### Blocks framed on the sheet
USB-C: J5
ST-LINK V2 debugger/Prog: P1

### Ports
D+, D-, RST (out), SWCLK (out), SWDIO (out)

### Nets
+5: J5.A4(VBUS) J5.A9(VBUS) J5.B4(VBUS) J5.B9(VBUS) P1.9 P1.10
GND: J5.1(MNT_1) J5.2(MNT_2) J5.3(MNT_3) J5.4(MNT_4) J5.A1(GND) J5.A12(GND) J5.B1(GND) J5.B12(GND) P1.5 P1.6
+3V3: P1.7 P1.8
D+: J5.A6(Dp1) J5.B6(Dp2) ; port D+
D-: J5.A7(Dn1) J5.B7(Dn2) ; port D-
RST: P1.1 ; port RST
SWCLK: P1.2 ; port SWCLK  [project net JTCK/SWCLK]
SWDIO: P1.4 ; port SWDIO  [project net JTMS/SWDIO]
SWIM: P1.3

Not connected (* = marked no-connect by the designer): J5 A5(CC1) A8(SBU1) B5(CC2) B8(SBU2)

### Notes on the sheet
- (near P1) @{"Id":"ALFROLGA\OAJMXLHG","ObjectType":2} is an ST-LINK V2 with its specific pinout

### Library data of the parts
J5 = CMP-196119-000001-2: CONN RCPT USB2.0 TYPE C 24POS RA; Gender: Receptacle; Number of Positions: 16; USB Standard: USB 2.0; Orientation: Right Angle; Contact Plating: Gold; Contact Material: Copper Alloy
P1 = CMP-2000-05031-1: Male Header, Pitch 2.54 mm, 2 x 5 Position, Height 9.3 mm, Tail Length 2.79 mm, -55 to 105 degC, RoHS, Bulk; Manufacturer: 3M; Current Rating: 1A; Brand: 3MElectronicSolutionsDivision; Mounting Angle: Straight; Number of Positions: 10Position; Mating Post Length: 5.99mm; Pitch: 2.54mm; Manufacturer URL: http://www.3m.com/; Factory Pack Quantity: 1000; Mounting Style: StraightPin; Number of Rows: 2Row; Termination Post Length: 2.79mm; Contact Gender: Pin(Male); Contact Material: Brass; Termination Style: ThroughHole; Product: Headers; Packaging: Tray; Product Category: Headers&WireHousings; Type: Shrouded; Datasheet URL: http://datasheet.octopart.com/30310-6002HB-3M-datasheet-11537585.pdf; Datasheet Version: Apr-12; Contact Plating: Gold; Row Spacing: 2.54mm; Housing Material: Polyester; Series: 303; RoHS: Details

## Sheet FTDI.SchDoc
size A4; SheetNumber: 5; SheetTotal: 7
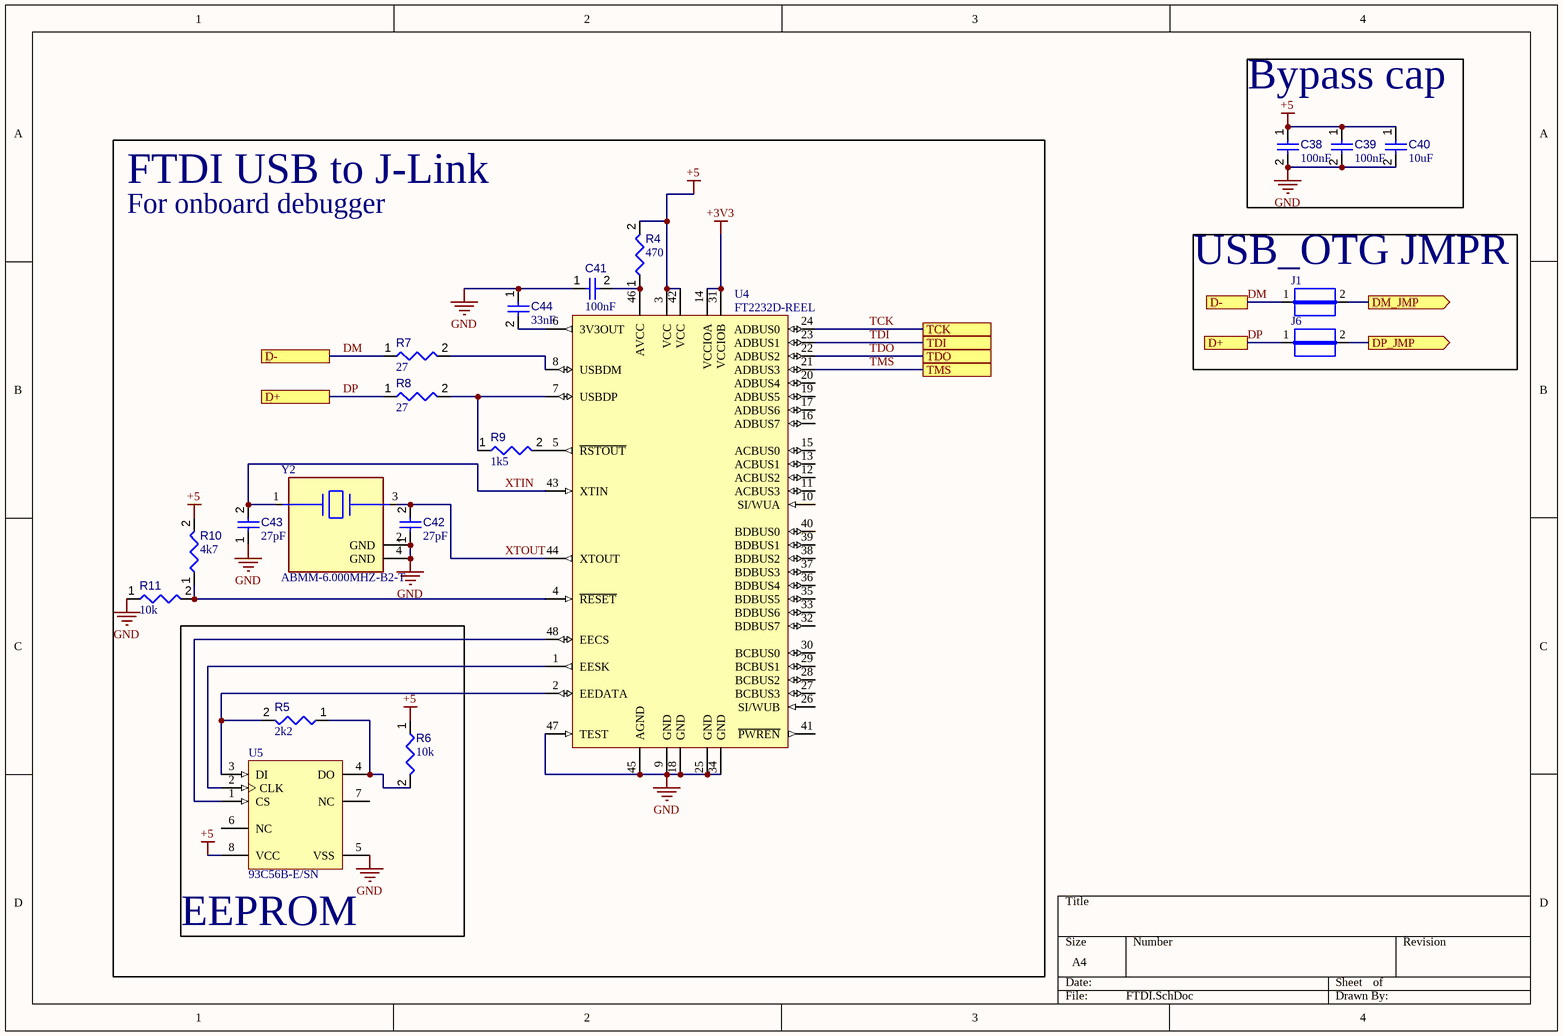
[diagram p4: FTDI.SchDoc]

### Parts
C38  value 100nF  [CAPC0603(1608)100_L]  (hidden comment: Capacitor 470nF +/-20% 25V 0603)
C39  value 100nF  [CAPC0603(1608)100_L]  (hidden comment: Capacitor 470nF +/-20% 25V 0603)
C40  value 10uF  [CAPC0603(1608)100_L]  (hidden comment: Capacitor 470nF +/-20% 25V 0603)
C41  value 100nF  [CAPC0603(1608)100_L]  (hidden comment: Capacitor 470nF +/-20% 25V 0603)
C42  value 27pF  [CAPC0603(1608)100_L]  (hidden comment: Capacitor 470nF +/-20% 25V 0603)
C43  value 27pF  [CAPC0603(1608)100_L]  (hidden comment: Capacitor 470nF +/-20% 25V 0603)
C44  value 33nF  [CAPC0603(1608)100_L]  (hidden comment: Capacitor 470nF +/-20% 25V 0603)
J1  JUMPER  [JUMPER]  (value not drawn)
J6  JUMPER  [JUMPER]  (value not drawn)
R4  value 470  [RESC0603(1608)_L]  (hidden comment: 120R3J)
R5  value 2k2  [RESC0603(1608)_L]  (hidden comment: 120R3J)
R6  value 10k  [RESC0603(1608)_L]  (hidden comment: 120R3J)
R7  value 27  [RESC0603(1608)_L]  (hidden comment: 120R3J)
R8  value 27  [RESC0603(1608)_L]  (hidden comment: 120R3J)
R9  value 1k5  [RESC0603(1608)_L]  (hidden comment: 120R3J)
R10  value 4k7  [RESC0603(1608)_L]  (hidden comment: 120R3J)
R11  value 10k  [RESC0603(1608)_L]  (hidden comment: 120R3J)
U4  FT2232D-REEL  [LQFP-48_L]
U5  93C56B-E/SN  [SOIC-SN8_M]
Y2  ABMM-6.000MHZ-B2-T  [FP-ABMM-MFG]

### Blocks framed on the sheet
Bypass cap: C38-C40
FTDI USB to J-Link: C41-C44 R4 R7-R11 U4 Y2
USB_OTG JMPR: J1 J6
EEPROM: R5 R6 U5

### Ports
D+, D-, DM_JMP (out), DP_JMP (out), TCK, TDI, TDO, TMS

### Nets
+3V3: U4.14(VCCIOA) U4.31(VCCIOB)
+5: C38.1 C39.1 C40.1 R4.2 R6.1 R10.2 U4.3(VCC) U4.42(VCC) U5.8(VCC)
GND: C38.2 C39.2 C40.2 C41.1 C42.1 C43.1 C44.1 R11.1 U4.9(GND) U4.18(GND) U4.25(GND) U4.34(GND) U4.45(AGND) U4.47(TEST) U5.5(VSS) Y2.2(GND) Y2.4(GND)
DM: J1.1 R7.1 ; port D-  [project net D-]
DP: J6.1 R8.1 ; port D+  [project net D+]
TCK: U4.24(ADBUS0) ; port TCK  [project net JTCK/SWCLK]
TDI: U4.23(ADBUS1) ; port TDI  [project net JTDI]
TDO: U4.22(ADBUS2) ; port TDO  [project net JTDO]
TMS: U4.21(ADBUS3) ; port TMS  [project net JTMS/SWDIO]
XTIN: C43.2 U4.43(XTIN) Y2.1
XTOUT: C42.2 U4.44(XTOUT) Y2.3
NetC41_2: C41.2 R4.1 U4.46(AVCC)
NetC44_2: C44.2 U4.6(3V3OUT)
NetJ1_2: J1.2 ; port DM_JMP
NetJ6_2: J6.2 ; port DP_JMP
NetR5_1: R5.1 R6.2 U5.4(DO)
NetR5_2: R5.2 U4.2(EEDATA) U5.3(DI)
NetR7_2: R7.2 U4.8(USBDM)
NetR8_2: R8.2 R9.1 U4.7(USBDP)
NetR9_2: R9.2 U4.5(~{RSTOUT})
NetR10_1: R10.1 R11.2 U4.4(~{RESET})
NetU4_1: U4.1(EESK) U5.2(CLK)
NetU4_48: U4.48(EECS) U5.1(CS)

Not connected (* = marked no-connect by the designer): U4 10(SI/WUA) 11(ACBUS3) 12(ACBUS2) 13(ACBUS1) 15(ACBUS0) 16(ADBUS7) 17(ADBUS6) 19(ADBUS5) 20(ADBUS4) 26(SI/WUB) 27(BCBUS3) 28(BCBUS2) 29(BCBUS1) 30(BCBUS0) 32(BDBUS7) 33(BDBUS6) 35(BDBUS5) 36(BDBUS4) 37(BDBUS3) 38(BDBUS2) 39(BDBUS1) 40(BDBUS0) 41(~{PWREN}); U5 6(NC) 7(NC)

### Notes on the sheet
- For onboard debugger

### Library data of the parts
C38-C44 = CMP-001-00077-3: as C1 on sheet MCU; Max Operating Temperature: 85°C; Voltage Rating: 25V; Pins: 2; Case/Package: 0603; Mounting Technology: SMT; Min Operating Temperature: -55°C
J1 J6 = CMP-009-00061-2: Pins: 2
R4-R11 = CMP-009-00069-2: as R3 on sheet MCU; Mounting Technology: SMT; Tolerance: 5%; Case/Package: 0603; Pins: 2
U4 = CMP-0579-00002-1: FT2232D Dual USB to Serial UART/FIFO IC, -40 to +85 degC, 48-Pin LQFP, Pb-Free, Tape and Reel; Manufacturer: FTDI; ComponentLink1Description: Manufacturer URL; ComponentLink1URL: http://www.ftdichip.com/; PackageDescription: 48-Pin Thin Quad Flat Pack, 7 x 7 mm Body, 0.5 mm Pitch; PackageVersion: Apr-11; PartNumber: FT2232D-REEL; ComponentLink2URL: http://www.ftdichip.com/Support/Documents/DataSheets/ICs/DS_FT2232D.pdf; ComponentLink2Description: Datasheet; PackageReference: LQFP-48; DatasheetVersion: ver 2.05, Apr-2011
U5 = CMP-0162-00233-1: 2K, 128x16-bit, 5.0V Microwire Serial EEPROM, 8-Pin SOIC 150mil, Extended Temperature; Code_JEDEC: MS-012; Code_IPC: SOIC127P600-8; DatasheetVersion: revF, May-2008; PackageReference: SOIC-SN8; PackageDescription: 8-Lead Plastic Small Outline (SN) - Narrow, 3.90mm Body [SOIC]; PackageVersion: revBB, Aug-2009
Y2 = CMP-27762-012698-1: CRYSTAL 6.0000MHZ 18PF SMD; Frequency Tolerance: 20ppm; Frequency: 6MHz; Series Resistance: 70R; Operating Frequency: 6 MHz; Frequency Stability: 50ppm; Load Capacitance: 18pF; Min Operating Temperature: -20°C; Number of Pins: 4; Packaging: Tape and Reel; Max Operating Temperature: 70°C; Case/Package: SMD/SMT; Tolerance: 20ppm; Height: 0.051inch; Mount: Surface Mount; Width: 5mm; Lead Free: Lead Free; Series: ABMM; ESR (Equivalent Series Resistance): 70R; Length: 0.276inch; Termination: SMD/SMT; Package Quantity: 1000; Resistor Type: Ceramic

## Sheet Codec.SchDoc
size A4; SheetNumber: 6; SheetTotal: 7
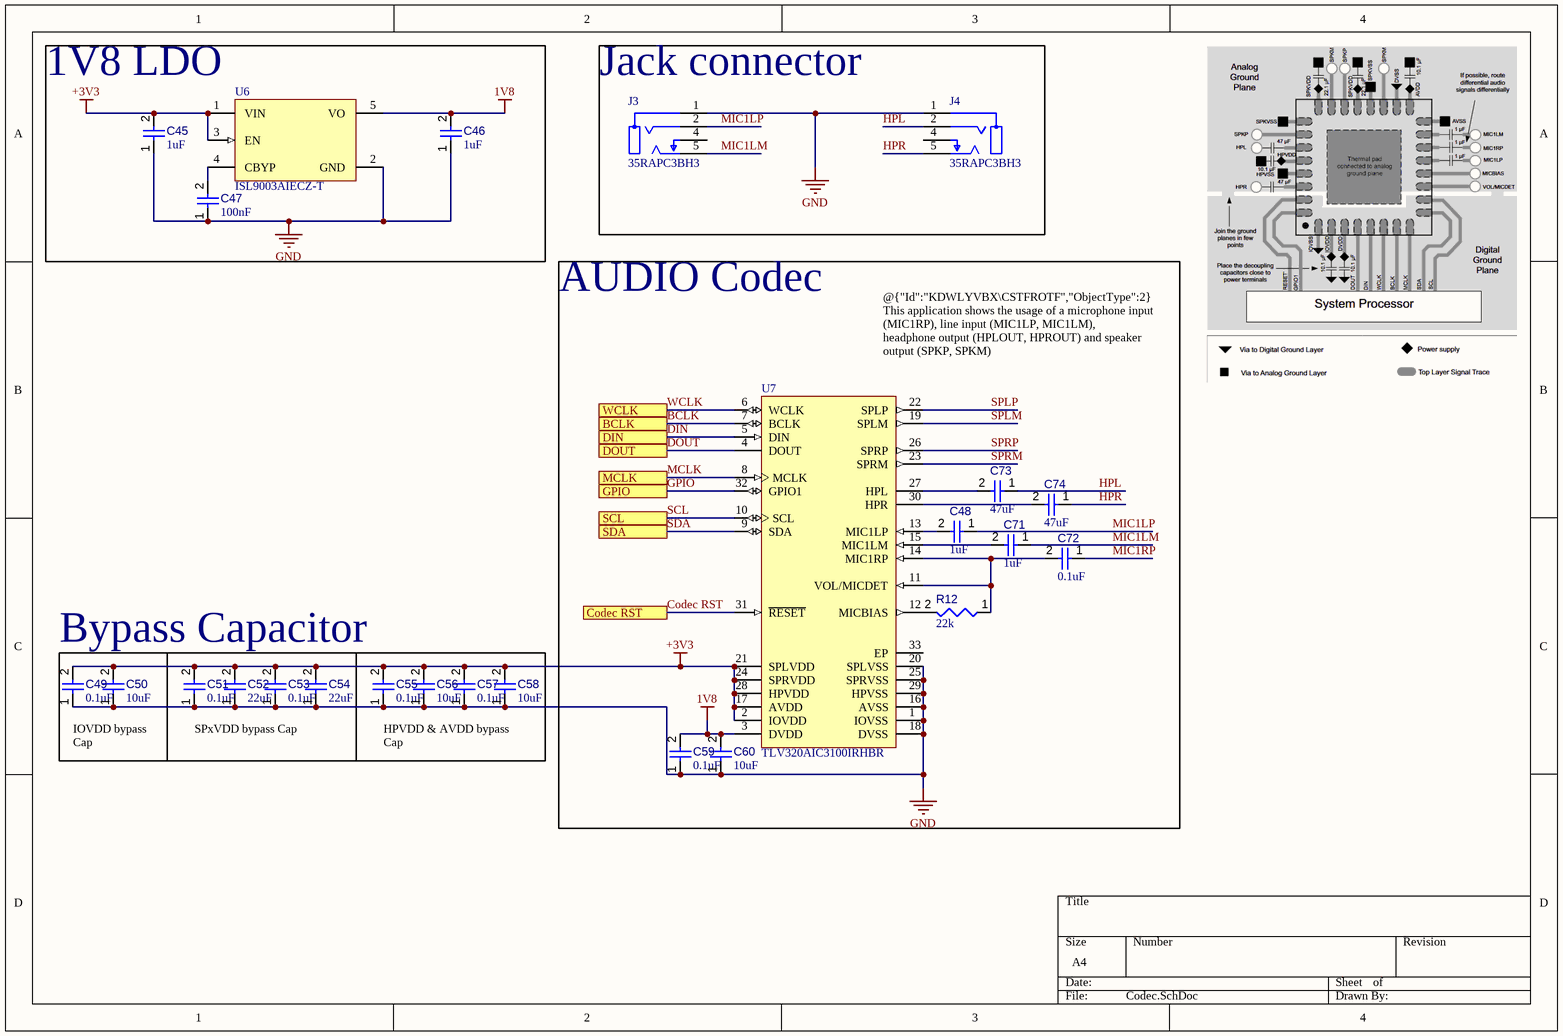
[diagram p5: Codec.SchDoc]

### Parts
C45  value 1uF  [CAPC0603(1608)100_L]  (hidden comment: Capacitor 470nF +/-20% 25V 0603)
C46  value 1uF  [CAPC0603(1608)100_L]  (hidden comment: Capacitor 470nF +/-20% 25V 0603)
C47  value 100nF  [CAPC0603(1608)100_L]  (hidden comment: Capacitor 470nF +/-20% 25V 0603)
C48  value 1uF  [CAPC0603(1608)100_L]  (hidden comment: Capacitor 470nF +/-20% 25V 0603)
C49  value 0.1uF  [CAPC0603(1608)100_L]  (hidden comment: Capacitor 470nF +/-20% 25V 0603)
C50  value 10uF  [CAPC0603(1608)100_L]  (hidden comment: Capacitor 470nF +/-20% 25V 0603)
C51  value 0.1uF  [CAPC0603(1608)100_L]  (hidden comment: Capacitor 470nF +/-20% 25V 0603)
C52  value 22uF  [CAPC0603(1608)100_L]  (hidden comment: Capacitor 470nF +/-20% 25V 0603)
C53  value 0.1uF  [CAPC0603(1608)100_L]  (hidden comment: Capacitor 470nF +/-20% 25V 0603)
C54  value 22uF  [CAPC0603(1608)100_L]  (hidden comment: Capacitor 470nF +/-20% 25V 0603)
C55  value 0.1uF  [CAPC0603(1608)100_L]  (hidden comment: Capacitor 470nF +/-20% 25V 0603)
C56  value 10uF  [CAPC0603(1608)100_L]  (hidden comment: Capacitor 470nF +/-20% 25V 0603)
C57  value 0.1uF  [CAPC0603(1608)100_L]  (hidden comment: Capacitor 470nF +/-20% 25V 0603)
C58  value 10uF  [CAPC0603(1608)100_L]  (hidden comment: Capacitor 470nF +/-20% 25V 0603)
C59  value 0.1uF  [CAPC0603(1608)100_L]  (hidden comment: Capacitor 470nF +/-20% 25V 0603)
C60  value 10uF  [CAPC0603(1608)100_L]  (hidden comment: Capacitor 470nF +/-20% 25V 0603)
C71  value 1uF  [CAPC0603(1608)100_L]  (hidden comment: Capacitor 470nF +/-20% 25V 0603)
C72  value 0.1uF  [CAPC0603(1608)100_L]  (hidden comment: Capacitor 470nF +/-20% 25V 0603)
C73  value 47uF  [CAPC0603(1608)100_L]  (hidden comment: Capacitor 470nF +/-20% 25V 0603)
C74  value 47uF  [CAPC0603(1608)100_L]  (hidden comment: Capacitor 470nF +/-20% 25V 0603)
J3  35RAPC3BH3  [FP-35RAPC3BH3-MFG]
J4  35RAPC3BH3  [FP-35RAPC3BH3-MFG]
R12  value 22k  [RESC0603(1608)_L]  (hidden comment: 120R3J)
U6  ISL9003AIECZ-T  [P5_049_MFG]
U7  TLV320AIC3100IRHBR  [RHB0032E_V]

### Blocks framed on the sheet
Jack connector: J3 J4
AUDIO Codec: C48 C59 C60 C71-C74 R12 U7
Bypass Capacitor: C49 C50

### Ports
BCLK, Codec RST, DIN, DOUT, GPIO, MCLK, SCL, SDA, WCLK

### Nets
1V8: C46.2 C59.2 C60.2 U6.5(VO) U7.3(DVDD)
+3V3: C45.2 C49.2 C50.2 C51.2 C52.2 C53.2 C54.2 C55.2 C56.2 C57.2 C58.2 U6.1(VIN) U6.3(EN) U7.2(IOVDD) U7.17(AVDD) U7.21(SPLVDD) U7.24(SPRVDD) U7.28(HPVDD)
GND: C45.1 C46.1 C47.1 C49.1 C50.1 C51.1 C52.1 C53.1 C54.1 C55.1 C56.1 C57.1 C58.1 C59.1 C60.1 J3.1 J4.1 U6.2(GND) U7.1(IOVSS) U7.16(AVSS) U7.18(DVSS) U7.20(SPLVSS) U7.25(SPRVSS) U7.29(HPVSS)
BCLK: U7.7(BCLK) ; port BCLK
Codec RST: U7.31(~{RESET}) ; port Codec RST
DIN: U7.5(DIN) ; port DIN
DOUT: U7.4(DOUT) ; port DOUT
GPIO: U7.32(GPIO1) ; port GPIO
HPL: C73.1 J4.2
HPR: C74.1 J4.5
MCLK: U7.8(MCLK) ; port MCLK  [project net I2S1_MCK]
MIC1LM: C71.1 J3.5
MIC1LP: C48.1 J3.2
MIC1RP: C72.1
SCL: U7.10(SCL) ; port SCL  [project net I2C1_SCL]
SDA: U7.9(SDA) ; port SDA  [project net I2C1_SDA]
SPLM: U7.19(SPLM)
SPLP: U7.22(SPLP)
SPRM: U7.23(SPRM)
SPRP: U7.26(SPRP)
WCLK: U7.6(WCLK) ; port WCLK  [project net I2S1_WS]
NetC47_2: C47.2 U6.4(CBYP)
NetC48_2: C48.2 U7.13(MIC1LP)
NetC71_2: C71.2 U7.15(MIC1LM)
NetC72_2: C72.2 R12.1 U7.11(VOL/MICDET) U7.14(MIC1RP)
NetC73_2: C73.2 U7.27(HPL)
NetC74_2: C74.2 U7.30(HPR)
NetR12_2: R12.2 U7.12(MICBIAS)

Not connected (* = marked no-connect by the designer): J3 4; J4 4; U7 33(EP)

### Notes on the sheet
- 1V8 LDO
- (near U7) @{"Id":"KDWLYVBX\CSTFROTF","ObjectType":2} This application shows the usage of a microphone input (MIC1RP), line input (MIC1LP, MIC1LM),
  headphone output (HPLOUT, HPROUT) and speaker output (SPKP, SPKM)
- IOVDD bypass Cap
- SPxVDD bypass Cap
- HPVDD & AVDD bypass Cap

### Library data of the parts
C45-C60 C71-C74 = CMP-001-00077-3: as C1 on sheet MCU; Max Operating Temperature: 85°C; Voltage Rating: 25V; Pins: 2; Case/Package: 0603; Mounting Technology: SMT; Min Operating Temperature: -55°C
J3 J4 = CMP-47983-000003-1: CONN JACK STEREO 3.5MM R/A; Gender: Female; Number of Positions: 3; Body Color: Black; Number of Ports: 1; Voltage Rating: 500V; Shielding: Unshielded; Body Material: Brass; Orientation: Right Angle; RoHS Compliant: Yes; Termination: Solder; Lead Free: Lead Free; Package Quantity: 1; Series: 35; Housing Material: PBT; Color: Black; Packaging: Bulk; Contact Plating: Silver; Mount: Through Hole; Contact Material: Copper Alloy; Number of Terminals/Pins: 3
R12 = CMP-009-00069-2: as R3 on sheet MCU; Mounting Technology: SMT; Tolerance: 5%; Case/Package: 0603; Pins: 2
U6 = CMP-00572-88255987-3: Active Positive GULL WING Not Qualified Linear Voltage Regulator IC 90dB 85C 150mA 2mm; Manufacturer Lifecycle Status: LAST TIME BUY; Accuracy: 0.8%; Min Current Limit: 175mA; Pitch: 700µm; Min Supply Voltage: 2.3V; Quiescent Current: 31µA; Dropout Voltage: 200mV; Number of Outputs: 1; Reference Voltage: 1V; Max Supply Voltage: 6.5V; Output Voltage: 1.8V; RAM Size: 512kB; Output Type: Fixed; ComponentLink3Description: Manufacturer's Package Drawing; Power Supply Rejection Ratio (PSRR): 90dB; ComponentLink3URL: https://www.renesas.com/en/document/psc/package-drawing-sc70-5pin-p5049; Max Operating Temperature: 85°C; Width: 1.2mm; Max Output Current: 150mA; Number of Pins: 5; Case/Package: SC; HelpURL: https://octopart.com/cad-content/api/get-model-datasheet/15189/88255987; ComponentLink2URL: https://octopart.com/cad-content/api/get-model-datasheet/15189/88255987; RoHS: Compliant; ComponentLink1URL: http://www.renesas.com; Length: 2mm; Lifecycle Status: EOL; Height: 1.1mm; Min Operating Temperature: -40°C; Polarity: Positive; ComponentLink1Description: Manufacturer's Website; Output Current: 150mA; Export Control Classification Number (ECCN) Code: EAR99; Min Input Voltage: 2.3V; Number of Regulators: 1; Max Input Voltage: 6.5V; ComponentLink2Description: Datasheet URL; Mount: Surface Mount
U7 = CMP-0331-00081-2: Low-Power Audio CODEC with Audio Processing and Mono Class-D Amplifier, 1 ADC and 2 DACs, 95 dB DAC SNR, -40 to 85 degC, 32-pin QFN (RHB), Green (RoHS & no Sb/Br); Manufacturer: Texas Instruments; Battery Powered: TRUE; Sampling Rate (Max) (kHz): 192; Digital Audio Interfaces: L, R, I2S, TDM, DSP; # ADCs (typ): 1; # DACs: 2; Control Interface: I2C; Additional Features: PLL, Mono Class-D Speaker Amplifier, Digital Mic Support; DAC SNR: 95; Speaker Amp Output Power(Max)(W): 2.5; PackageReference: RHB0032E; PackageDescription: 32-Pin Plastic Quad Flat No-Lead, 5 x 5 mm Body, 0.5 mm Pitch, 3.45 x 3.45 mm Exposed Pad; ComponentLink1URL: http://www.ti.com/general/docs/lit/getliterature.tsp?genericPartNumber=TLV320AIC3100&fileType=pdf; Code_JEDEC: MO-220; PartNumber: TLV320AIC3100IRHBR; DatasheetVersion: SLAS667A; Speaker Amp Type: Class-D; Headphone Driver: TRUE; ComponentLink1Description: Datasheet; PackageVersion: revD, Jun-2011; Speaker Amp Ouputs: 1; Mounting Technology: Surface Mount

## Sheet Onboard interfaces.SchDoc
size A4; SheetNumber: 7; SheetTotal: 7
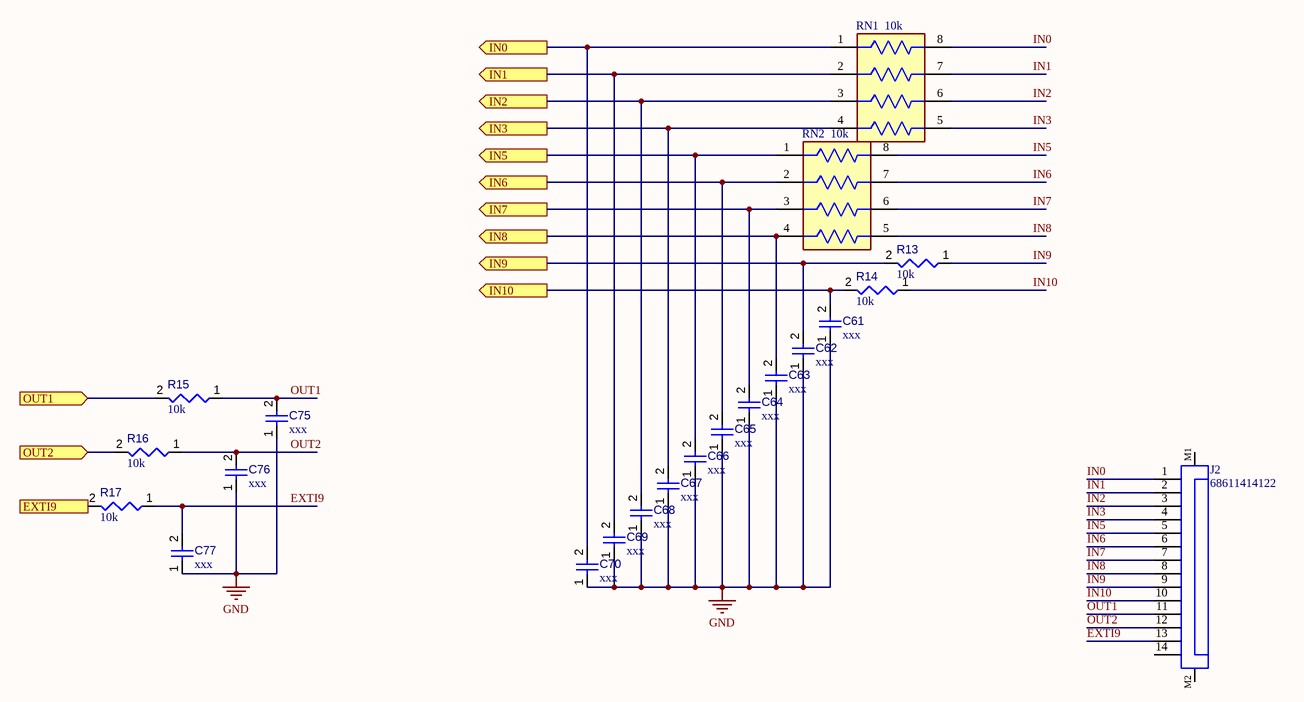
[diagram p6: Onboard interfaces.SchDoc]

### Parts
C61  value xxx  [CAPC0603(1608)100_L]  (hidden comment: Capacitor 470nF +/-20% 25V 0603)
C62  value xxx  [CAPC0603(1608)100_L]  (hidden comment: Capacitor 470nF +/-20% 25V 0603)
C63  value xxx  [CAPC0603(1608)100_L]  (hidden comment: Capacitor 470nF +/-20% 25V 0603)
C64  value xxx  [CAPC0603(1608)100_L]  (hidden comment: Capacitor 470nF +/-20% 25V 0603)
C65  value xxx  [CAPC0603(1608)100_L]  (hidden comment: Capacitor 470nF +/-20% 25V 0603)
C66  value xxx  [CAPC0603(1608)100_L]  (hidden comment: Capacitor 470nF +/-20% 25V 0603)
C67  value xxx  [CAPC0603(1608)100_L]  (hidden comment: Capacitor 470nF +/-20% 25V 0603)
C68  value xxx  [CAPC0603(1608)100_L]  (hidden comment: Capacitor 470nF +/-20% 25V 0603)
C69  value xxx  [CAPC0603(1608)100_L]  (hidden comment: Capacitor 470nF +/-20% 25V 0603)
C70  value xxx  [CAPC0603(1608)100_L]  (hidden comment: Capacitor 470nF +/-20% 25V 0603)
C75  value xxx  [CAPC0603(1608)100_L]  (hidden comment: Capacitor 470nF +/-20% 25V 0603)
C76  value xxx  [CAPC0603(1608)100_L]  (hidden comment: Capacitor 470nF +/-20% 25V 0603)
C77  value xxx  [CAPC0603(1608)100_L]  (hidden comment: Capacitor 470nF +/-20% 25V 0603)
J2  68611414122  [68611414122]
R13  value 10k  [RESC0603(1608)_L]  (hidden comment: 120R3J)
R14  value 10k  [RESC0603(1608)_L]  (hidden comment: 120R3J)
R15  value 10k  [RESC0603(1608)_L]  (hidden comment: 120R3J)
R16  value 10k  [RESC0603(1608)_L]  (hidden comment: 120R3J)
R17  value 10k  [RESC0603(1608)_L]  (hidden comment: 120R3J)
RN1  10k  [FP-YC164-MFG]
RN2  10k  [FP-YC164-MFG]

### Ports
EXTI9 (out), IN0 (out), IN1 (out), IN2 (out), IN3 (out), IN5 (out), IN6 (out), IN7 (out), IN8 (out), IN9 (out), IN10 (out), OUT1 (in), OUT2 (in)

### Nets
GND: C61.1 C62.1 C63.1 C64.1 C65.1 C66.1 C67.1 C68.1 C69.1 C70.1 C75.1 C76.1 C77.1
ADC1_IN0: C70.2 RN1.1 ; port IN0
ADC1_IN1: C69.2 RN1.2 ; port IN1
ADC1_IN2: C68.2 RN1.3 ; port IN2
ADC1_IN3: C67.2 RN1.4 ; port IN3
ADC1_IN5: C66.2 RN2.1 ; port IN5
ADC1_IN6: C65.2 RN2.2 ; port IN6
ADC1_IN7: C64.2 RN2.3 ; port IN7
ADC1_IN8: C63.2 RN2.4 ; port IN8
ADC1_IN9: C62.2 R13.2 ; port IN9
ADC1_IN10: C61.2 R14.2 ; port IN10
DAC1_OUT1: R15.2 ; port OUT1
DAC1_OUT2: R16.2 ; port OUT2
EXTI9: C77.2 J2.13 R17.1
IN0: J2.1 RN1.8
IN1: J2.2 RN1.7
IN2: J2.3 RN1.6
IN3: J2.4 RN1.5
IN5: J2.5 RN2.8
IN6: J2.6 RN2.7
IN7: J2.7 RN2.6
IN8: J2.8 RN2.5
IN9: J2.9 R13.1
IN10: J2.10 R14.1
OUT1: C75.2 J2.11 R15.1
OUT2: C76.2 J2.12 R16.1
NetR17_2: R17.2 ; port EXTI9

Not connected (* = marked no-connect by the designer): J2 14 M1 M2

### Library data of the parts
C61-C70 C75-C77 = CMP-001-00077-3: as C1 on sheet MCU; Max Operating Temperature: 85°C; Voltage Rating: 25V; Pins: 2; Case/Package: 0603; Mounting Technology: SMT; Min Operating Temperature: -55°C
J2 = CMP-1502-01474-2: NexarPartId: 8917684; Gender: Male; Current Rating: 1A; Voltage Rating: 125V; Pitch: 1mm; Insulation Resistance: 100MΩ; Actuator Material: Polyphenylene; Contact Resistance: 20mΩ; Number of Contacts: 14; Flammability Rating: UL94 V-0; Width: 2.95mm; Lead Pitch: 1mm; RoHS: Compliant; Housing Material: Polyphenylene; Min Operating Temperature: -25°C; Number of Rows: 1; Contact Material: Bronze, Tin; Contact Plating: Tin; Mount: Surface Mount; Number of Pins: 14; Orientation: Horizontal; Length: 21mm; Termination: Solder; Packaging: Tape and Reel; Operating Supply Voltage: 125V; Max Operating Temperature: 85°C; REACH SVHC: No SVHC; Number of Positions: 14
R13-R17 = CMP-009-00069-2: as R3 on sheet MCU; Mounting Technology: SMT; Tolerance: 5%; Case/Package: 0603; Pins: 2
RN1 RN2 = CMP-03411-000003-1: RES ARRAY 4 RES 10K OHM 1206; Resistance Tolerance: 5%; Power Per Element: 62.5mW; Number of Circuits: 4; Number of Terminals/Pins: 8; Voltage Rating: 50V; Resistance: 10kR; Circuit Type: Isolated; Tolerance: 1%; Temperature Coefficient: 200ppm/°C; Depth: 1.6mm; Termination: SMD/SMT; Technology: THICK FILM; Lead Free: Lead Free; Min Operating Temperature: -55°C; Number of Elements: 4; Series: YC164; Radiation Hardening: No; Length: 0.126inch; Width: 0.063inch; Case Code (Metric): 3216; Number of Pins: 8; Package Quantity: 5000; Number of Contacts: 8; Working Voltage: 50V; Packaging: Tape and Reel; Height: 0.028inch; Mount: Surface Mount; Number of Resistors: 4; Case Code (Imperial): 1206; Size Code: 0603; Terminal Pitch: 0.8mm; Military Standard: Not; Power Dissipation: 62.5mW; Case/Package: 0164; RoHS Compliant: Yes; Max Operating Temperature: 155°C

## Nets that join several sheets
+3V3: MCU (49 pins), SMPS (C31.2 L1.2 R1.2), FTDI (U4.14 U4.31), Codec (18 pins)
+5: SMPS (C30.2 U3.3), USB interface (6 pins), FTDI (9 pins)
GND: MCU (86 pins), SMPS (C30.1 C31.1 R2.1 U3.1), USB interface (10 pins), FTDI (17 pins), Codec (24 pins), Onboard interfaces (13 pins)
ADC1_IN0: MCU (U1.T1), Onboard interfaces (C70.2 RN1.1)
ADC1_IN1: MCU (U1.T2), Onboard interfaces (C69.2 RN1.2)
ADC1_IN2: MCU (U1.T7), Onboard interfaces (C68.2 RN1.3)
ADC1_IN3: MCU (U1.R3), Onboard interfaces (C67.2 RN1.4)
ADC1_IN5: MCU (U1.T5), Onboard interfaces (C66.2 RN2.1)
ADC1_IN6: MCU (U1.R7), Onboard interfaces (C65.2 RN2.2)
ADC1_IN7: MCU (U1.R5), Onboard interfaces (C64.2 RN2.3)
ADC1_IN8: MCU (U1.U4), Onboard interfaces (C63.2 RN2.4)
ADC1_IN9: MCU (U1.U5), Onboard interfaces (C62.2 R13.2)
ADC1_IN10: MCU (U1.L2), Onboard interfaces (C61.2 R14.2)
BCLK: MCU (U1.B9), Codec (U7.7)
Codec RST: MCU (U1.T17), Codec (U7.31)
D+: USB interface (J5.A6 J5.B6), FTDI (J6.1 R8.1)
D-: USB interface (J5.A7 J5.B7), FTDI (J1.1 R7.1)
DAC1_OUT1: MCU (U1.U3), Onboard interfaces (R15.2)
DAC1_OUT2: MCU (U1.T3), Onboard interfaces (R16.2)
DIN: MCU (U1.A10), Codec (U7.5)
DOUT: MCU (U1.A5), Codec (U7.4)
GPIO: MCU (U1.T16), Codec (U7.32)
I2C1_SCL: MCU (U1.D5), Codec (U7.10)
I2C1_SDA: MCU (U1.C5), Codec (U7.9)
I2S1_MCK: MCU (U1.T4), Codec (U7.8)
I2S1_WS: MCU (U1.A9), Codec (U7.6)
JTCK/SWCLK: MCU (U1.B14), USB interface (P1.2), FTDI (U4.24)
JTDI: MCU (U1.A14), FTDI (U4.23)
JTDO: MCU (U1.C6), FTDI (U4.22)
JTMS/SWDIO: MCU (U1.C15), USB interface (P1.4), FTDI (U4.21)
NetJ1_2: MCU (U1.E17), FTDI (J1.2)
NetJ6_2: MCU (U1.E16), FTDI (J6.2)
NetR17_2: MCU (U1.D4), Onboard interfaces (R17.2)
RST: MCU (C32.2 SW1.2 U1.K1), USB interface (P1.1)